# EasyEDA schematic SCH_kxmx_kaugummi_4.0_2021-10-22.json
TITLE: Sheet_1; REV: 1.0; Date: 2019-05-09; Sheet: 1/1; Drawn By: recursinging; Company: Your Company
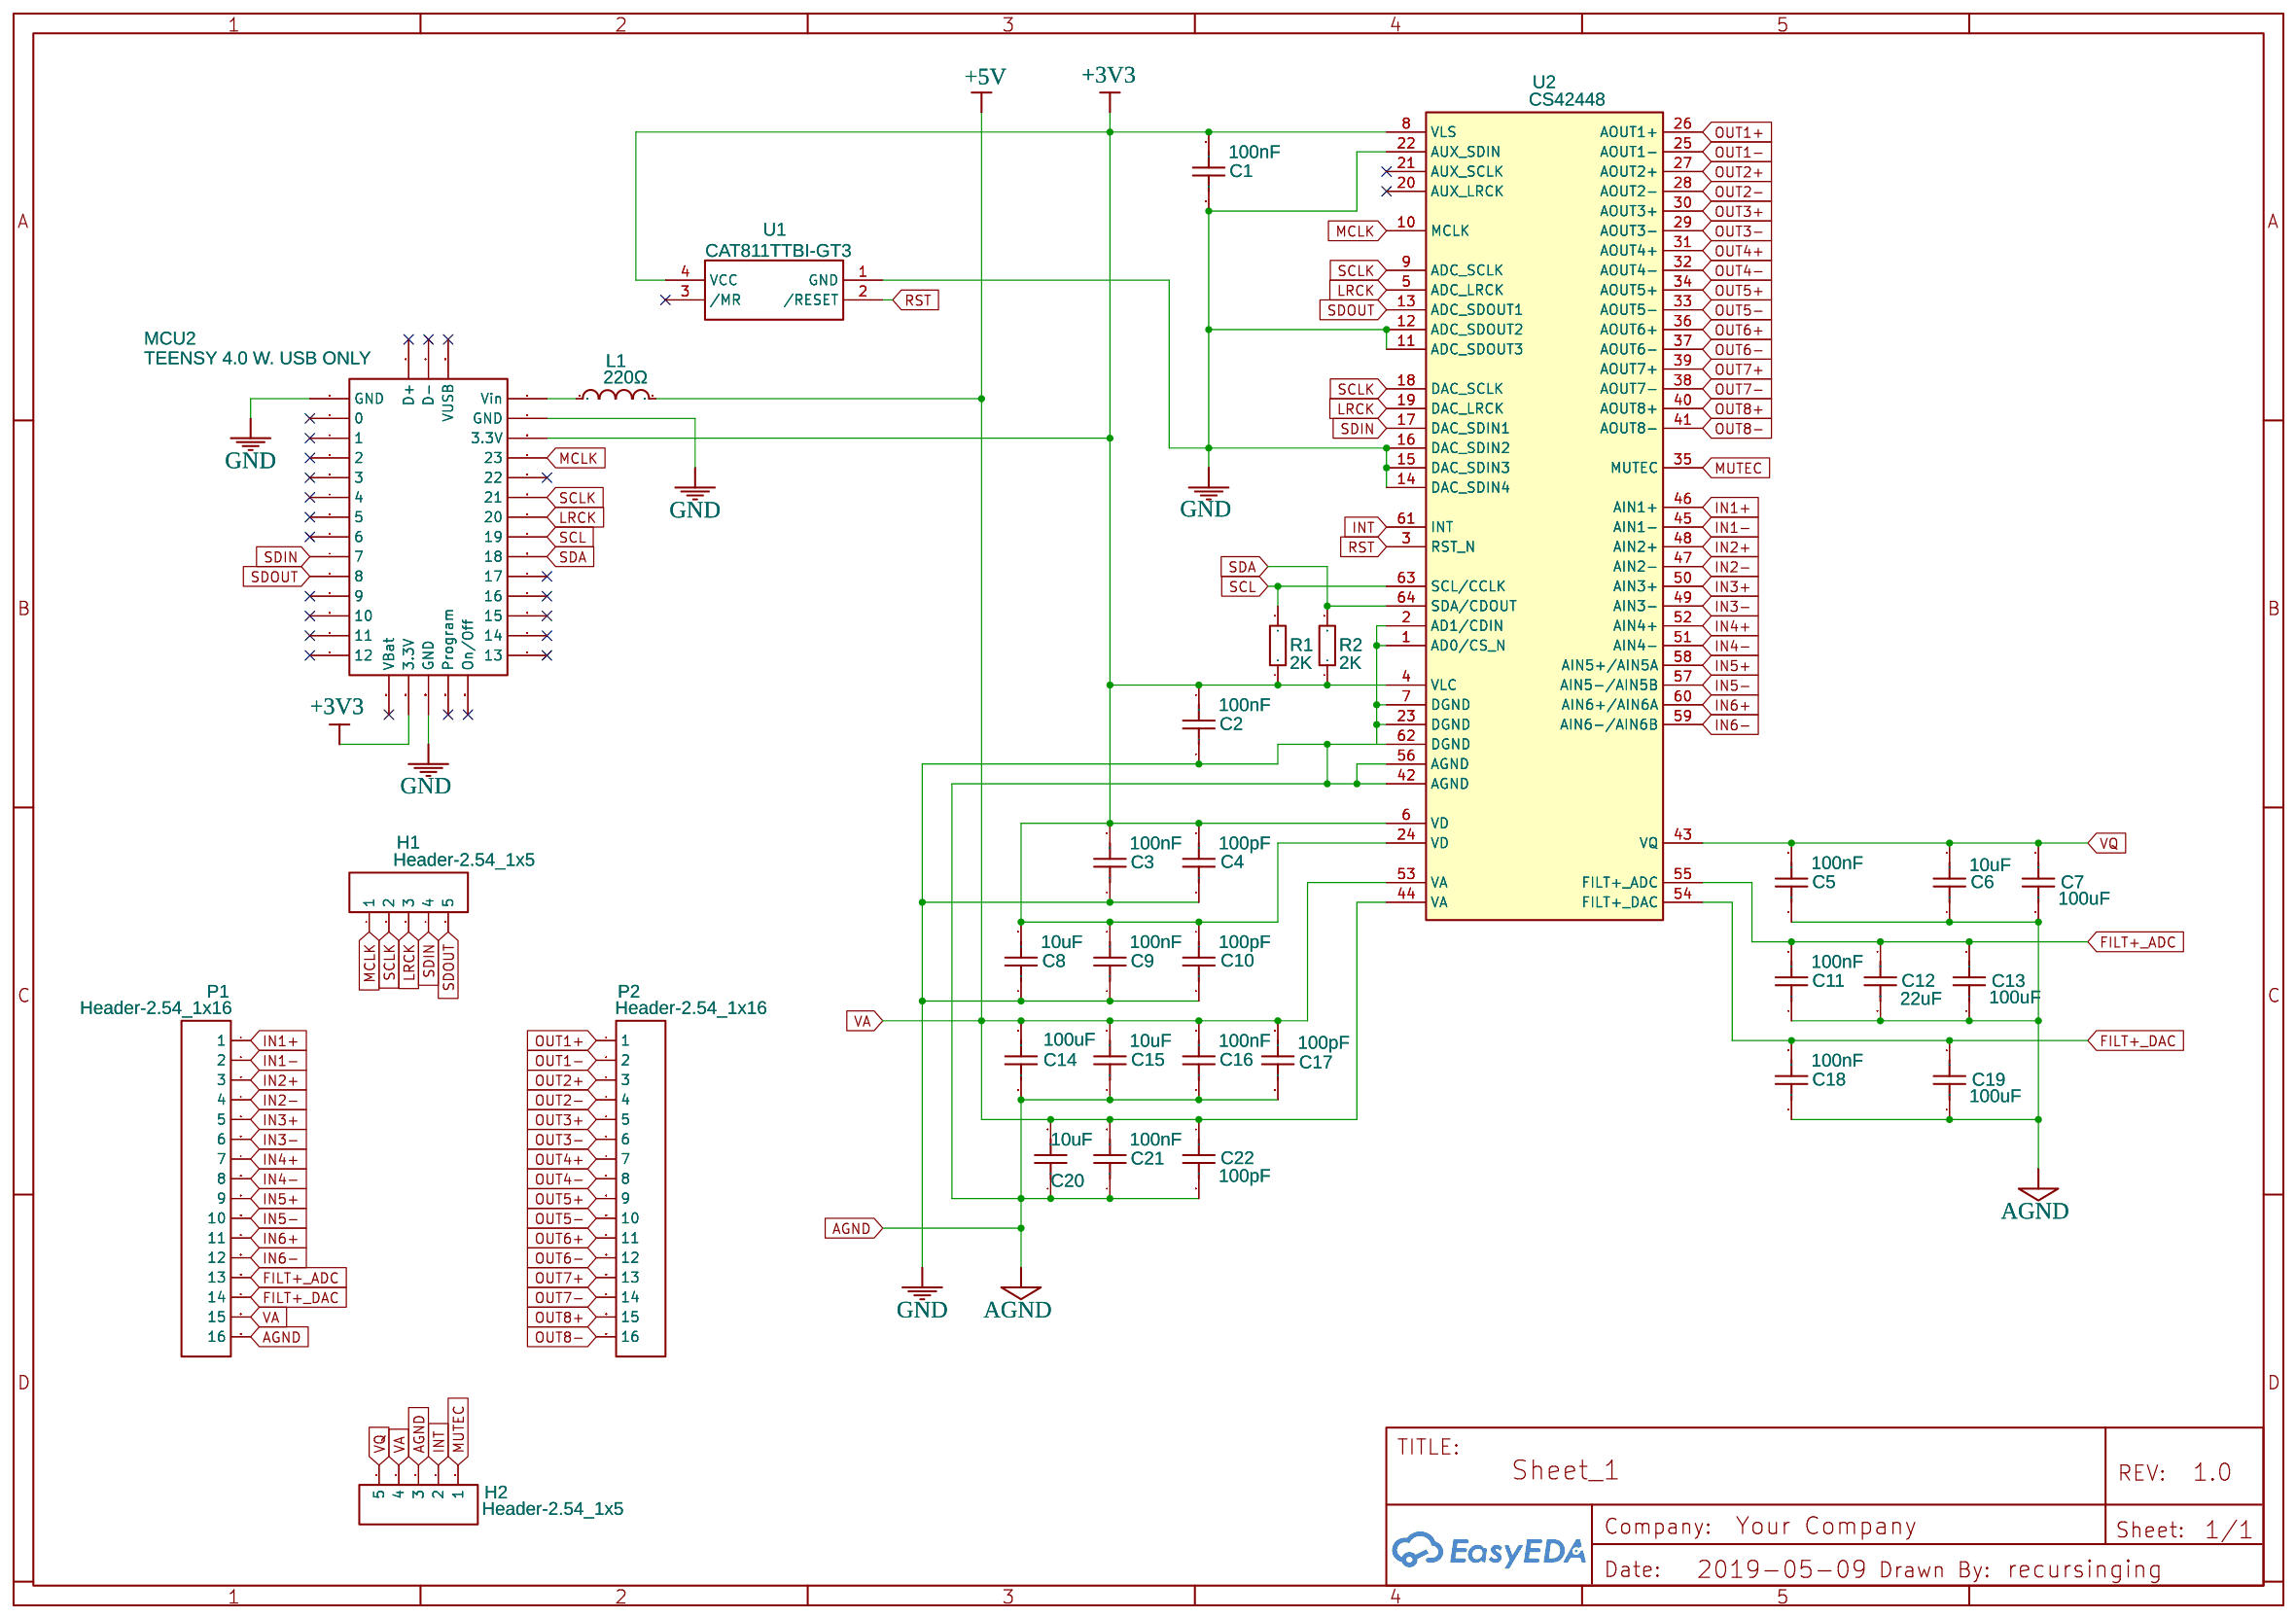
[diagram p0: schematic sheet]

## Parts
C1  100nF  [0603]
C2  100nF  [0603]
C3  100nF  [0603]
C4  100pF  [0603]
C5  100nF  [0603]
C6  10uF  [0603]
C7  100uF  [1206]
C8  10uF  [0603]
C9  100nF  [0603]
C10  100pF  [0603]
C11  100nF  [0603]
C12  22uF  [0603]
C13  100uF  [1206]
C14  100uF  [1206]
C15  10uF  [0603]
C16  100nF  [0603]
C17  100pF  [0603]
C18  100nF  [0603]
C19  100uF  [1206]
C20  10uF  [0603]
C21  100nF  [0603]
C22  100pF  [0603]
H1  Header-2.54_1x5  [HDR-5X1/2.54]
H2  Header-2.54_1x5  [HDR-5X1/2.54]
L1  220Ω  [0805]
MCU2  TEENSY 4.0 W. USB ONLY  [TEENSY 4.0 W. USB ONLY]
P1  Header-2.54_1x16  [HDR-16X1/2.54]
P2  Header-2.54_1x16  [HDR-16X1/2.54]
R1  2K  [0603]
R2  2K  [0603]
U1  CAT811TTBI-GT3  [SOT-143]
U2  CS42448  [LQFP64-10X10]

## Library data of the parts
C1-C3 C5 C9 C11 C16 C18 C21 = CL10B104KA8NNNC: Supplier: LCSC; Manufacturer: SAMSUNG; Supplier Part: C1590
C4 C10 C17 C22 = 0603B101K500CT: Supplier: LCSC; Supplier Part: C338150; Manufacturer: Walsin Tech Corp; Contributor: LCSC
C6 C8 C15 C20 = CL10A106MQ8NNNC: Supplier: LCSC; Manufacturer: SAMSUNG; Supplier Part: C1691
C7 C13 C14 C19 = GRM31CR60J107ME39L: Supplier: LCSC; Manufacturer: MuRata; Supplier Part: C77085
C12 = CL10A226MQ8NRNE: Supplier: LCSC; Manufacturer: SAMSUNG; Contributor: LCSC; Supplier Part: C159801
H1 H2 = -: Supplier: LCSC; Manufacturer: BOOMELE; Manufacturer Part: 2.54mm 1*5p Female header; image: //image.lceda.cn/szlcsc/C50950.jpg; Supplier Part: C50950
L1 = BLM21PG221SH1D: Supplier: LCSC; Manufacturer: MuRata; Supplier Part: C88994
MCU2 = -: Contributor: recursinging
P1 P2 = -: Supplier: LCSC; Manufacturer: BOOMELE; Manufacturer Part: Female header1*16P pitch 2.54mm; image: //image.lceda.cn/szlcsc/C66987.jpg; Supplier Part: C66987
R1 R2 = RTT03202JTP: Supplier: LCSC; Manufacturer: RALEC; Supplier Part: C103396
U1 = -: Supplier: LCSC; Manufacturer: ON; Supplier Part: C73274
U2 = -: 6/8 Ch Audio CoDeC; Manufacturer Part: ?

## Nets
+3V3: C1.2 C2.2 C3.2 C4.1 C8.2 C9.2 C10.1 MCU2.3V30(3.3V) MCU2.3V31(3.3V) R1.1 R2.1 U1.4(VCC) U2.4(VLC) U2.6(VD) U2.8(VLS) U2.24(VD)
+5V: C14.2 C15.2 C16.2 C17.1 C20.2 C21.2 C22.1 H2.4 L1.2 P1.15 U2.44(VA) U2.53(VA)
AGND: C1.1 C2.1 C3.1 C4.2 C5.1 C6.1 C7.1 C8.1 C9.1 C10.2 C11.1 C12.2 C13.1 C14.1 C15.1 C16.1 C17.2 C18.1 C19.1 C20.1 C21.1 C22.2 H2.3 MCU2.GND0(GND) MCU2.GND1(GND) MCU2.GND2(GND) P1.16 U1.1(GND) U2.1(AD0/CS_N) U2.2(AD1/CDIN) U2.7(DGND) U2.11(ADC_SDOUT3) U2.12(ADC_SDOUT2) U2.14(DAC_SDIN4) U2.15(DAC_SDIN3) U2.16(DAC_SDIN2) U2.22(AUX_SDIN) U2.23(DGND) U2.42(AGND) U2.56(AGND) U2.62(DGND)
FILT+_ADC: C11.2 C12.1 C13.2 P1.13 U2.55(FILT+_ADC)
FILT+_DAC: C18.2 C19.2 P1.14 U2.54(FILT+_DAC)
IN1+: P1.1 U2.46(AIN1+)
IN1-: P1.2 U2.45(AIN1-)
IN2+: P1.3 U2.48(AIN2+)
IN2-: P1.4 U2.47(AIN2-)
IN3+: P1.5 U2.50(AIN3+)
IN3-: P1.6 U2.49(AIN3-)
IN4+: P1.7 U2.52(AIN4+)
IN4-: P1.8 U2.51(AIN4-)
IN5+: P1.9 U2.58(AIN5+/AIN5A)
IN5-: P1.10 U2.57(AIN5-/AIN5B)
IN6+: P1.11 U2.60(AIN6+/AIN6A)
IN6-: P1.12 U2.59(AIN6-/AIN6B)
INT: H2.2 U2.61(INT)
LRCK: H1.3 MCU2.20 U2.5(ADC_LRCK) U2.19(DAC_LRCK)
MCLK: H1.1 MCU2.23 U2.10(MCLK)
MUTEC: H2.1 U2.35(MUTEC)
OUT1+: P2.1 U2.26(AOUT1+)
OUT1-: P2.2 U2.25(AOUT1-)
OUT2+: P2.3 U2.27(AOUT2+)
OUT2-: P2.4 U2.28(AOUT2-)
OUT3+: P2.5 U2.30(AOUT3+)
OUT3-: P2.6 U2.29(AOUT3-)
OUT4+: P2.7 U2.31(AOUT4+)
OUT4-: P2.8 U2.32(AOUT4-)
OUT5+: P2.9 U2.34(AOUT5+)
OUT5-: P2.10 U2.33(AOUT5-)
OUT6+: P2.11 U2.36(AOUT6+)
OUT6-: P2.12 U2.37(AOUT6-)
OUT7+: P2.13 U2.39(AOUT7+)
OUT7-: P2.14 U2.38(AOUT7-)
OUT8+: P2.15 U2.40(AOUT8+)
OUT8-: P2.16 U2.41(AOUT8-)
RST: U1.2(/RESET) U2.3(RST_N)
SCL: MCU2.19 R1.2 U2.63(SCL/CCLK)
SCLK: H1.2 MCU2.21 U2.9(ADC_SCLK) U2.18(DAC_SCLK)
SDA: MCU2.18 R2.2 U2.64(SDA/CDOUT)
SDIN: H1.4 MCU2.7 U2.17(DAC_SDIN1)
SDOUT: H1.5 MCU2.8 U2.13(ADC_SDOUT1)
VQ: C5.2 C6.2 C7.2 H2.5 U2.43(VQ)
Net-(L1-1): L1.1 MCU2.VIN(Vin)

Not connected (* = marked no-connect by the designer): MCU2 0* 1* 2* 3* 4* 5* 6* 9* 10* 11* 12* 13* 14* 15* 16* 17* 22* D+* D-* ONOFF(On/Off)* PRGM(Program)* VBAT(VBat)* VUSB*; U1 3(/MR)*; U2 20(AUX_LRCK)* 21(AUX_SCLK)*
